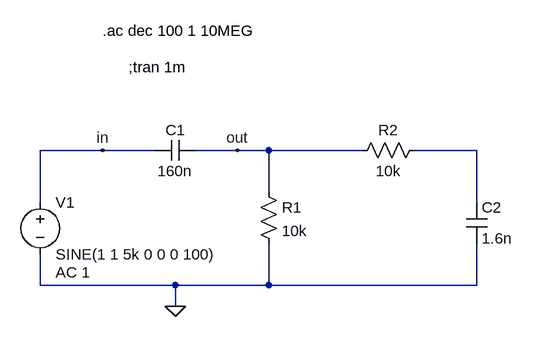
[diagram p0: schematic Priklad3.asc]
Priklad3.asc, the LTspice schematic file:
Version 4
SHEET 1 880 680
WIRE -112 -16 -208 -16
WIRE -32 -16 -112 -16
WIRE 96 -16 32 -16
WIRE 144 -16 96 -16
WIRE 288 -16 144 -16
WIRE 464 -16 368 -16
WIRE 144 48 144 -16
WIRE -208 64 -208 -16
WIRE 464 64 464 -16
WIRE -208 192 -208 144
WIRE 0 192 -208 192
WIRE 144 192 144 128
WIRE 144 192 0 192
WIRE 464 192 464 128
WIRE 464 192 144 192
WIRE 0 224 0 192
FLAG 0 224 0
FLAG -112 -16 in
FLAG 96 -16 out
SYMBOL voltage -208 48 R0
WINDOW 123 24 124 Left 2
WINDOW 39 0 0 Left 2
SYMATTR InstName V1
SYMATTR Value SINE(1 1 5k 0 0 0 100)
SYMATTR Value2 AC 1
SYMBOL res 128 32 R0
SYMATTR InstName R1
SYMATTR Value 10k
SYMBOL cap -32 0 R270
WINDOW 0 32 32 VTop 2
WINDOW 3 0 32 VBottom 2
SYMATTR InstName C1
SYMATTR Value 160n
SYMBOL res 384 -32 R90
WINDOW 0 0 56 VBottom 2
WINDOW 3 32 56 VTop 2
SYMATTR InstName R2
SYMATTR Value 10k
SYMBOL cap 448 64 R0
SYMATTR InstName C2
SYMATTR Value 1.6n
TEXT -112 -200 Left 2 !.ac dec 100 1 10MEG
TEXT -72 -144 Left 2 !;tran 1m

The netlist it stands for:
* Priklad3.asc
V1 in 0 SINE(1 1 5k 0 0 0 100) AC 1
R1 out 0 10k
C1 in out 160n
R2 N001 out 10k
C2 N001 0 1.6n
.ac dec 100 1 10MEG
;tran 1m
.backanno
.end